# Altium schematic sheet 5600BB3T Dev.Board.SchDoc
size 594 x 420 mm; Author: A_D; Revision: Версия 1.0; SheetTotal: 1; PageSetup: Record=PageOptions|CenterHorizontal=True|CenterVertical=True|PrintScale=0.32|XCorrection=1.00|YCorrection=1.00|PrintKind=2|BorderSize=5000000|LeftOffset=9000|BottomOffset=10100|Orientation=2|PaperLength=11176|PaperWidth=8636|Scale=100|PaperSource=259|PrintQuality=600|MediaType=1|DitherType=10|PaperKind=Letter|PrintScaleMode=1; Weight: -; ScaleFactor: -
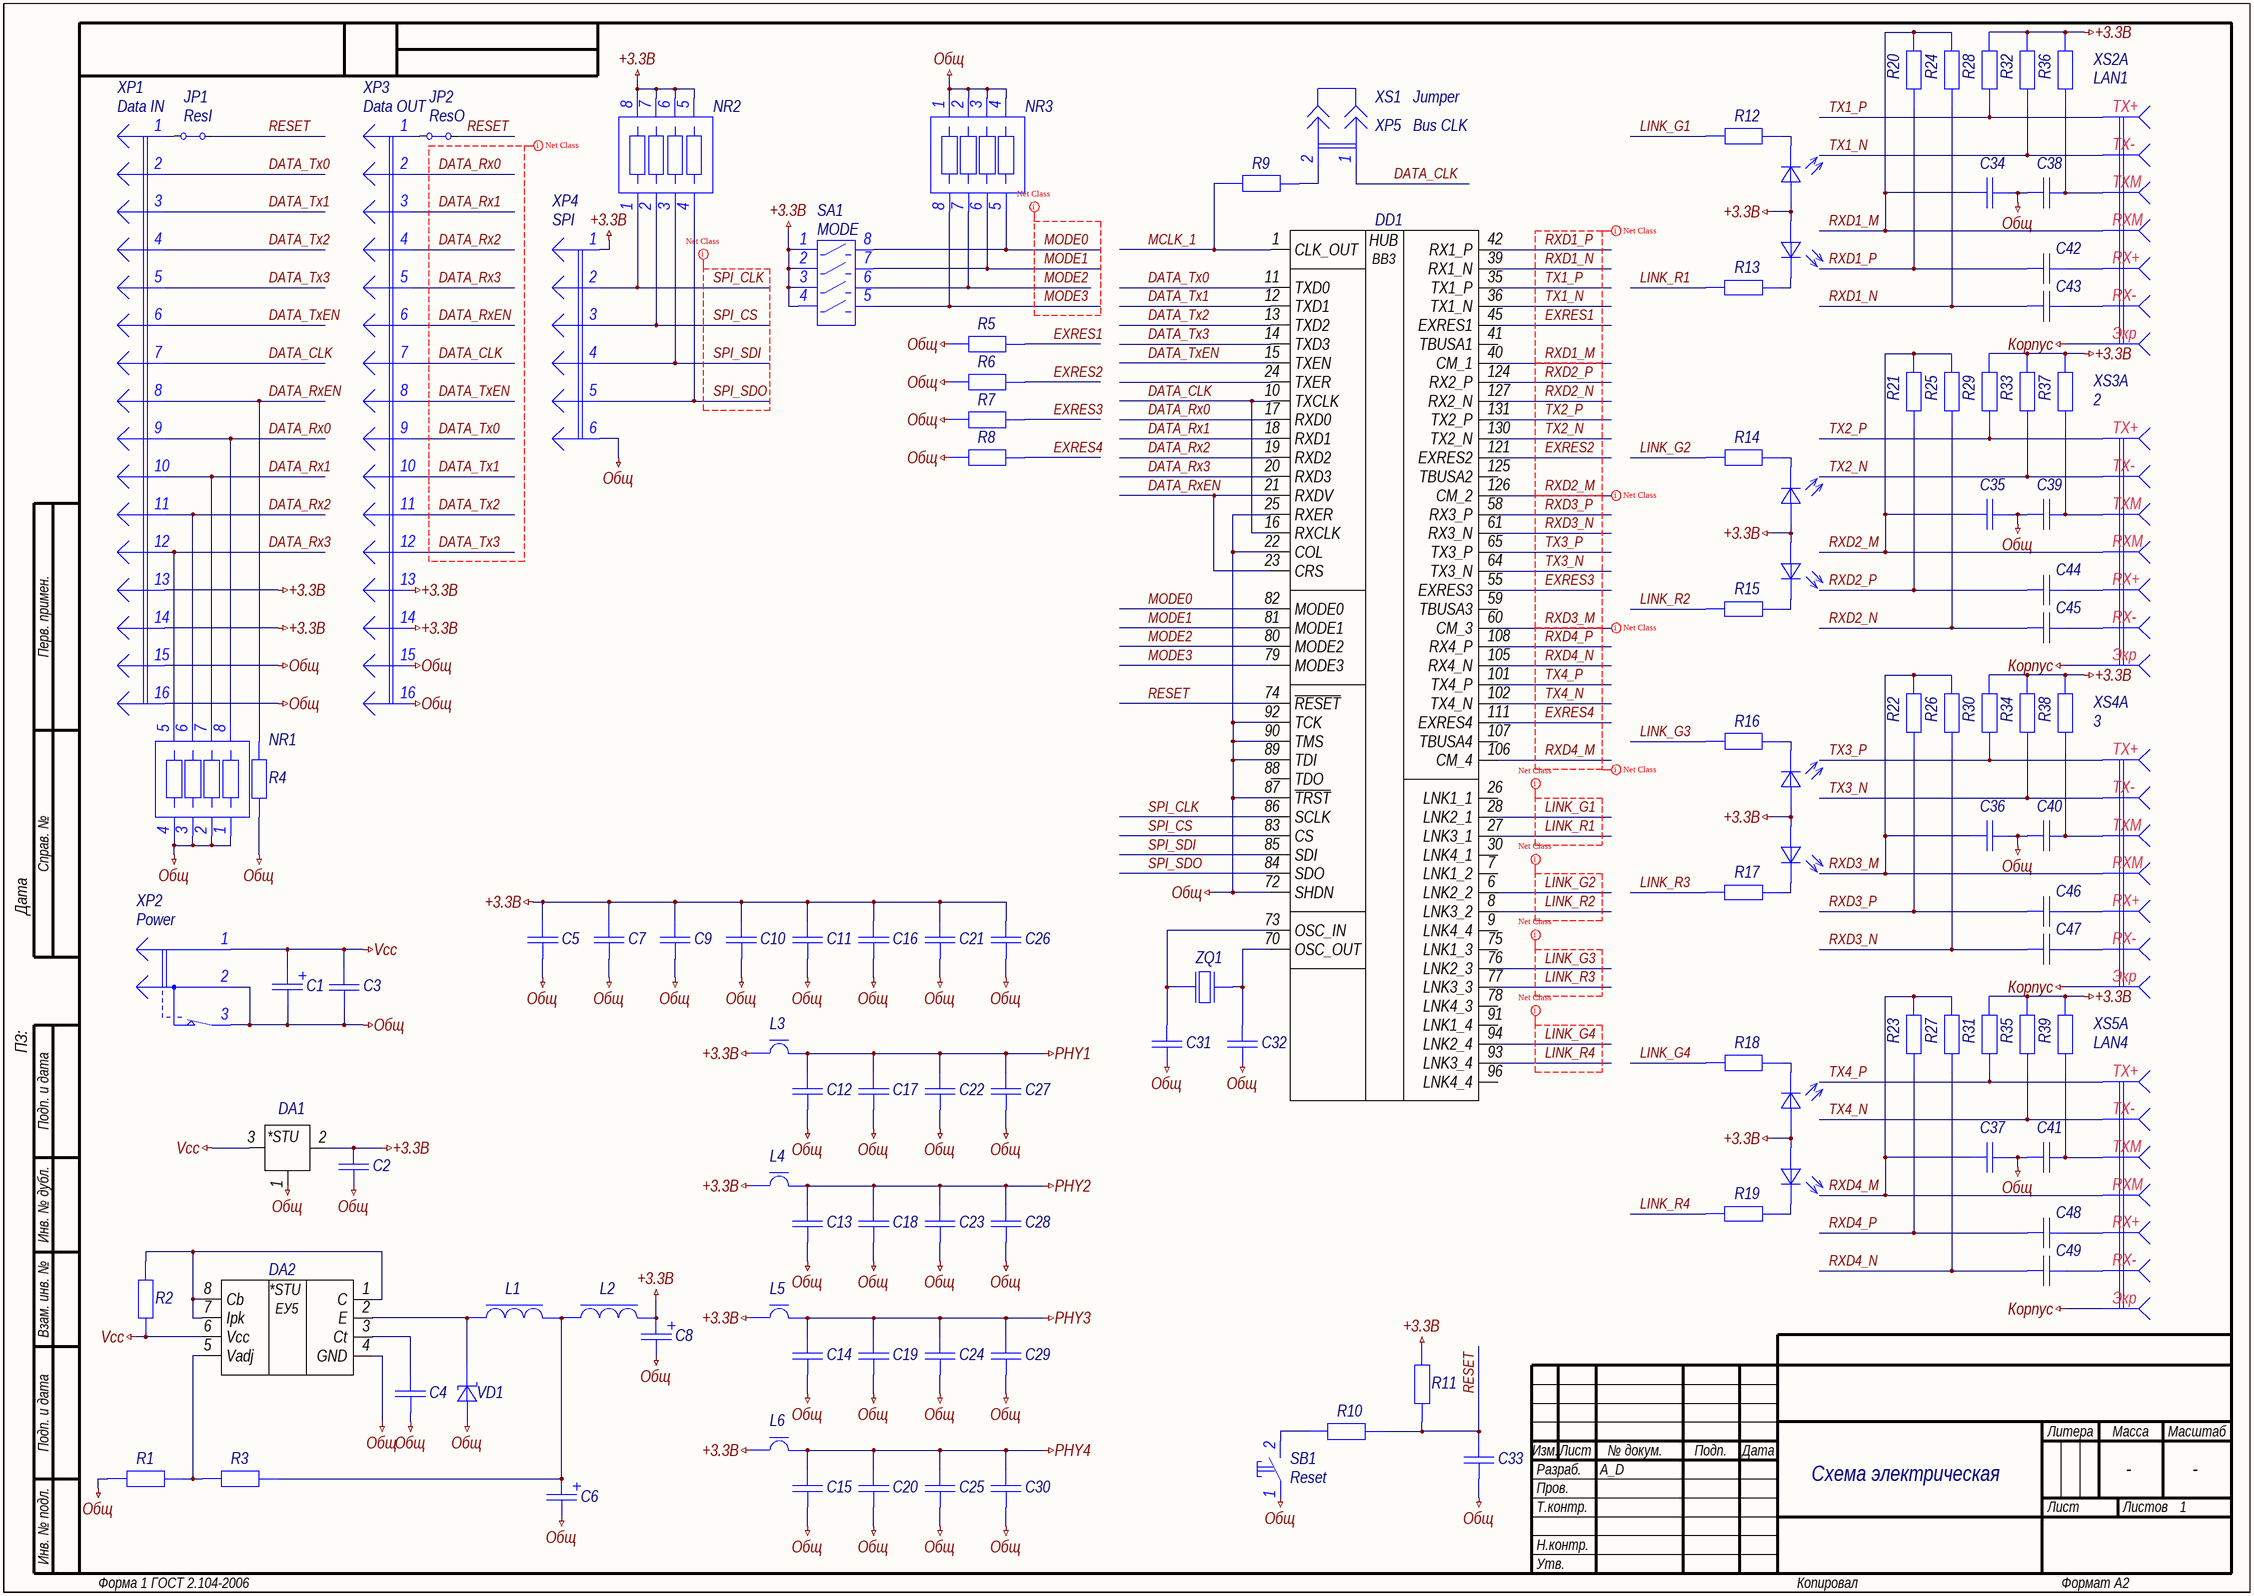
[diagram p0: 5600BB3T Dev.Board.SchDoc]

## Parts
C1  Capacitor-T  [C7343H-P]  (value not drawn)
C2  Capacitor  [C0805]  (value not drawn)  (no BOM)
C3  Capacitor  [C0805]  (value not drawn)
C4  Capacitor  [C0805]  (value not drawn)
C5  Capacitor  [C0805]  (value not drawn)
C6  Capacitor-T  [C7343H-P]  (value not drawn)
C7  Capacitor  [C0805]  (value not drawn)
C8  Capacitor-T  [C7343-P]  (value not drawn)
C9  Capacitor  [C0805]  (value not drawn)
C10  Capacitor  [C0805]  (value not drawn)
C11  Capacitor  [C0805]  (value not drawn)
C12  Capacitor  [C0805]  (value not drawn)
C13  Capacitor  [C0805]  (value not drawn)
C14  Capacitor  [C0805]  (value not drawn)
C15  Capacitor  [C0805]  (value not drawn)
C16  Capacitor  [C0805]  (value not drawn)
C17  Capacitor  [C0805]  (value not drawn)
C18  Capacitor  [C0805]  (value not drawn)
C19  Capacitor  [C0805]  (value not drawn)
C20  Capacitor  [C0805]  (value not drawn)
C21  Capacitor  [C0805]  (value not drawn)
C22  Capacitor  [C0805]  (value not drawn)
C23  Capacitor  [C0805]  (value not drawn)
C24  Capacitor  [C0805]  (value not drawn)
C25  Capacitor  [C0805]  (value not drawn)
C26  Capacitor  [C0805]  (value not drawn)
C27  Capacitor  [C0805]  (value not drawn)
C28  Capacitor  [C0805]  (value not drawn)
C29  Capacitor  [C0805]  (value not drawn)
C30  Capacitor  [C0805]  (value not drawn)
C31  Capacitor  [C0805]  (value not drawn)
C32  Capacitor  [C0805]  (value not drawn)
C33  Capacitor  [C0805]  (value not drawn)
C34  Capacitor  [C0805]  (value not drawn)
C35  Capacitor  [C0805]  (value not drawn)
C36  Capacitor  [C0805]  (value not drawn)
C37  Capacitor  [C0805]  (value not drawn)
C38  Capacitor  [C0805]  (value not drawn)
C39  Capacitor  [C0805]  (value not drawn)
C40  Capacitor  [C0805]  (value not drawn)
C41  Capacitor  [C0805]  (value not drawn)
C42  Capacitor  [C0805]  (value not drawn)
C43  Capacitor  [C0805]  (value not drawn)
C44  Capacitor  [C0805]  (value not drawn)
C45  Capacitor  [C0805]  (value not drawn)
C46  Capacitor  [C0805]  (value not drawn)
C47  Capacitor  [C0805]  (value not drawn)
C48  Capacitor  [C0805]  (value not drawn)
C49  Capacitor  [C0805]  (value not drawn)
DA1  LM1117-Series  [SOT-223]  (value not drawn)  (no BOM)
DA2  1156ЕУ5  [SO8]  (value not drawn)
DD1  5600ВВ3Т  [4229.132-3]  (value not drawn)
JP1  ResI  [JS-S-2x]  (net tie, no BOM)
JP2  ResO  [JS-S-2x]  (net tie, no BOM)
L1  Coil  [CDRH127]  (value not drawn)
L2  Coil  [SDR0604-Series]  (value not drawn)
L3  FerriteBead  [L0805]  (value not drawn)
L4  FerriteBead  [L0805]  (value not drawn)
L5  FerriteBead  [L0805]  (value not drawn)
L6  FerriteBead  [L0805]  (value not drawn)
NR1  Resistor-4  [CAY16-x4]  (value not drawn)
NR2  Resistor-4  [CAY16-x4]  (value not drawn)
NR3  Resistor-4  [CAY16-x4]  (value not drawn)
R1  Resistor  [R0805]  (value not drawn)
R2  Resistor  [R1206]  (value not drawn)
R3  Resistor  [R0805]  (value not drawn)
R4  Resistor  [R0805]  (value not drawn)
R5  Resistor  [R0805]  (value not drawn)
R6  Resistor  [R0805]  (value not drawn)
R7  Resistor  [R0805]  (value not drawn)
R8  Resistor  [R0805]  (value not drawn)
R9  Resistor  [R0805]  (value not drawn)
R10  Resistor  [R0805]  (value not drawn)
R11  Resistor  [R0805]  (value not drawn)
R12  Resistor  [R0805]  (value not drawn)
R13  Resistor  [R0805]  (value not drawn)
R14  Resistor  [R0805]  (value not drawn)
R15  Resistor  [R0805]  (value not drawn)
R16  Resistor  [R0805]  (value not drawn)
R17  Resistor  [R0805]  (value not drawn)
R18  Resistor  [R0805]  (value not drawn)
R19  Resistor  [R0805]  (value not drawn)
R20  Resistor  [R0805]  (value not drawn)
R21  Resistor  [R0805]  (value not drawn)
R22  Resistor  [R0805]  (value not drawn)
R23  Resistor  [R0805]  (value not drawn)
R24  Resistor  [R0805]  (value not drawn)
R25  Resistor  [R0805]  (value not drawn)
R26  Resistor  [R0805]  (value not drawn)
R27  Resistor  [R0805]  (value not drawn)
R28  Resistor  [R0805]  (value not drawn)
R29  Resistor  [R0805]  (value not drawn)
R30  Resistor  [R0805]  (value not drawn)
R31  Resistor  [R0805]  (value not drawn)
R32  Resistor  [R0805]  (value not drawn)
R33  Resistor  [R0805]  (value not drawn)
R34  Resistor  [R0805]  (value not drawn)
R35  Resistor  [R0805]  (value not drawn)
R36  Resistor  [R0805]  (value not drawn)
R37  Resistor  [R0805]  (value not drawn)
R38  Resistor  [R0805]  (value not drawn)
R39  Resistor  [R0805]  (value not drawn)
SA1  MODE  [ВДМЗ-4]
SB1  Reset  [ВКн1]
VD1  Schottky  [DO-214AA]  (value not drawn)
XP1  Data IN  [IDC-16MS]
XP2  Power  [DJK-02-Series]
XP3  Data OUT  [IDC-16MS]
XP4  SPI  [PLS-6]
XP5  Bus CLK  [PLS-2]
XS1  Jumper  [MJ-O-Series]
XS2  LAN1  [SK02-111006NL]  (parts A,B,C of 3)
XS3  2  [SK02-111006NL]  (parts A,B,C of 3)
XS4  3  [SK02-111006NL]  (parts A,B,C of 3)
XS5  LAN4  [SK02-111006NL]  (parts A,B,C of 3)
ZQ1  Crystal  [SMD 7x5mm]  (value not drawn)

## Nets
+3.3B: C2.2 C5.2 C7.2 C8.1 C9.2 C10.2 C11.2 C16.2 C21.2 C26.2 DA1.2(Out) DD1.3(Vcc) DD1.29(Vcc) DD1.67(Vcc) DD1.95(Vcc) L2.2 L3.1 L4.1 L5.1 L6.1 NR2.5 NR2.6 NR2.7 NR2.8 R11.2 R28.2 R29.2 R30.2 R31.2 R32.2 R33.2 R34.2 R35.2 R36.2 R37.2 R38.2 R39.2 SA1.1(A1) SA1.2(A2) SA1.3(A3) SA1.4(A4) XP1.13 XP1.14 XP3.13 XP3.14 XP4.1 XS2.9(LD1+) XS2.12(LD2+) XS3.9(LD1+) XS3.12(LD2+) XS4.9(LD1+) XS4.12(LD2+) XS5.9(LD1+) XS5.12(LD2+)
PHY1: C12.2 C17.2 C22.2 C27.2 DD1.37(Vcca1) DD1.43(Vcca1) DD1.47(Vcca1) DD1.49(Vcca1) L3.2
PHY2: C13.2 C18.2 C23.2 C28.2 DD1.117(Vcca2) DD1.119(Vcca2) DD1.123(Vcca2) DD1.129(Vcca2) L4.2
PHY3: C14.2 C19.2 C24.2 C29.2 DD1.51(Vcca3) DD1.53(Vcca3) DD1.56(Vcca3) DD1.63(Vcca3) L5.2
PHY4: C15.2 C20.2 C25.2 C30.2 DD1.103(Vcca4) DD1.109(Vcca4) DD1.113(Vcca4) DD1.115(Vcca4) L6.2
Vcc: C1.1 C3.2 DA1.3(In) DA2.6(Vcc) R2.1 XP2.1
Корпус: XS2.13 XS3.13 XS4.13 XS5.13
Общ: C1.2 C2.1 C3.1 C4.1 C5.1 C6.2 C7.1 C8.2 C9.1 C10.1 C11.1 C12.1 C13.1 C14.1 C15.1 C16.1 C17.1 C18.1 C19.1 C20.1 C21.1 C22.1 C23.1 C24.1 C25.1 C26.1 C27.1 C28.1 C29.1 C30.1 C31.1 C32.1 C33.1 C34.2 C35.2 C36.2 C37.2 C38.1 C39.1 C40.1 C41.1 DA1.1(Adj/GND) DA2.4(GND) DD1.4(GND) DD1.5(GND) DD1.22(COL) DD1.25(RXER) DD1.31(GND) DD1.33(GND) DD1.34(GNDА1) DD1.38(GNDА1) DD1.44(GNDА1) DD1.46(GNDА1) DD1.48(GNDА1) DD1.50(GND) DD1.52(GNDА3) DD1.54(GNDА3) DD1.57(GNDА3) DD1.62(GNDА3) DD1.66(GNDА3) DD1.68(GND) DD1.71(GND) DD1.72(SHDN) DD1.87(~{TRST}) DD1.89(TDI) DD1.90(TMS) DD1.92(TCK) DD1.97(GND) DD1.99(GND) DD1.100(GNDА4) DD1.104(GNDА4) DD1.110(GNDА4) DD1.112(GNDА4) DD1.114(GNDА4) DD1.116(GND) DD1.118(GNDА2) DD1.120(GNDА2) DD1.122(GNDА2) DD1.128(GNDА2) DD1.132(GNDА2) NR1.1 NR1.2 NR1.3 NR1.4 NR3.1 NR3.2 NR3.3 NR3.4 R1.2 R4.1 R5.1 R6.1 R7.1 R8.1 SB1.1 VD1.1(А) XP1.15 XP1.16 XP2.2 XP2.3 XP3.15 XP3.16 XP4.6
DATA_CLK: DD1.10(TXCLK) DD1.16(RXCLK) XP1.7 XP3.7 XP5.1
DATA_Rx0: DD1.17(RXD0) NR1.8 XP1.9 XP3.2
DATA_Rx1: DD1.18(RXD1) NR1.7 XP1.10 XP3.3
DATA_Rx2: DD1.19(RXD2) NR1.6 XP1.11 XP3.4
DATA_Rx3: DD1.20(RXD3) NR1.5 XP1.12 XP3.5
DATA_RxEN: DD1.21(RXDV) DD1.23(CRS) R4.2 XP1.8 XP3.6
DATA_Tx0: DD1.11(TXD0) XP1.2 XP3.9
DATA_Tx1: DD1.12(TXD1) XP1.3 XP3.10
DATA_Tx2: DD1.13(TXD2) XP1.4 XP3.11
DATA_Tx3: DD1.14(TXD3) XP1.5 XP3.12
DATA_TxEN: DD1.15(TXEN) XP1.6 XP3.8
EXRES1: DD1.45(EXRES1) R5.2
EXRES2: DD1.121(EXRES2) R6.2
EXRES3: DD1.55(EXRES3) R7.2
EXRES4: DD1.111(EXRES4) R8.2
LINK_G1: DD1.28(LNK2_1) R12.1
LINK_G2: DD1.6(LNK2_2) R14.1
LINK_G3: DD1.76(LNK2_3) R16.1
LINK_G4: DD1.94(LNK2_4) R18.1
LINK_R1: DD1.27(LNK3_1) R13.1
LINK_R2: DD1.8(LNK3_2) R15.1
LINK_R3: DD1.77(LNK3_3) R17.1
LINK_R4: DD1.93(LNK3_4) R19.1
MCLK_1: DD1.1(CLK_OUT) R9.1
MODE0: DD1.82(MODE0) NR3.5 SA1.8(A8)
MODE1: DD1.81(MODE1) NR3.6 SA1.7(A7)
MODE2: DD1.80(MODE2) NR3.7 SA1.6(A6)
MODE3: DD1.79(MODE3) NR3.8 SA1.5(A5)
RESET: C33.2 DD1.74(~{RESET}) JP1.2 JP2.2 R10.2 R11.1
RXD1_M: C34.1 DD1.40(CM_1) R20.2 R24.2 XS2.6
RXD1_N: C43.1 DD1.39(RX1_N) R24.1
RXD1_P: C42.1 DD1.42(RX1_P) R20.1
RXD2_M: C35.1 DD1.126(CM_2) R21.2 R25.2 XS3.6
RXD2_N: C45.1 DD1.127(RX2_N) R25.1
RXD2_P: C44.1 DD1.124(RX2_P) R21.1
RXD3_M: C36.1 DD1.60(CM_3) R22.2 R26.2 XS4.6
RXD3_N: C47.1 DD1.61(RX3_N) R26.1
RXD3_P: C46.1 DD1.58(RX3_P) R22.1
RXD4_M: C37.1 DD1.106(CM_4) R23.2 R27.2 XS5.6
RXD4_N: C49.1 DD1.105(RX4_N) R27.1
RXD4_P: C48.1 DD1.108(RX4_P) R23.1
SPI_CLK: DD1.86(SCLK) NR2.1 XP4.2
SPI_CS: DD1.83(СS) NR2.2 XP4.3
SPI_SDI: DD1.85(SDI) NR2.3 XP4.4
SPI_SDO: DD1.84(SDO) NR2.4 XP4.5
TX1_N: DD1.36(TX1_N) R32.1 XS2.2
TX1_P: DD1.35(TX1_P) R28.1 XS2.1
TX2_N: DD1.130(TX2_N) R33.1 XS3.2
TX2_P: DD1.131(TX2_P) R29.1 XS3.1
TX3_N: DD1.64(TX3_N) R34.1 XS4.2
TX3_P: DD1.65(TX3_P) R30.1 XS4.1
TX4_N: DD1.102(TX4_N) R35.1 XS5.2
TX4_P: DD1.101(TX4_P) R31.1 XS5.1
NetC4_2: C4.2 DA2.3(Ct)
NetC6_1: C6.1 L1.2 L2.1 R3.2
NetC31_2: C31.2 DD1.73(OSC_IN) ZQ1.1
NetC32_2: C32.2 DD1.70(OSC_OUT) ZQ1.3
NetC38_2: C38.2 R36.1 XS2.3
NetC39_2: C39.2 R37.1 XS3.3
NetC40_2: C40.2 R38.1 XS4.3
NetC41_2: C41.2 R39.1 XS5.3
NetC42_2: C42.2 XS2.7
NetC43_2: C43.2 XS2.8
NetC44_2: C44.2 XS3.7
NetC45_2: C45.2 XS3.8
NetC46_2: C46.2 XS4.7
NetC47_2: C47.2 XS4.8
NetC48_2: C48.2 XS5.7
NetC49_2: C49.2 XS5.8
NetDA2_1: DA2.1(С) DA2.7(Ipk) DA2.8(Cb) R2.2
NetDA2_2: DA2.2(E) L1.1 VD1.2(К)
NetDA2_5: DA2.5(Vadj) R1.1 R3.1
NetJP1_1: JP1.1 XP1.1
NetJP2_1: JP2.1 XP3.1
NetR9_2: R9.2 XP5.2
NetR10_1: R10.1 SB1.2
NetR12_2: R12.2 XS2.10(LD1-)
NetR13_2: R13.2 XS2.11(LD2-)
NetR14_2: R14.2 XS3.10(LD1-)
NetR15_2: R15.2 XS3.11(LD2-)
NetR16_2: R16.2 XS4.10(LD1-)
NetR17_2: R17.2 XS4.11(LD2-)
NetR18_2: R18.2 XS5.10(LD1-)
NetR19_2: R19.2 XS5.11(LD2-)

Not connected (* = marked no-connect by the designer): DD1 2(DVcc) 7(LNK1_2) 9(LNK4_4) 24(TXER) 26(LNK1_1) 30(LNK4_1) 32(DVcc) 41(TBUSA1) 59(TBUSA3) 69(DVcc) 75(LNK1_3) 78(LNK4_3) 88(TDO) 91(LNK1_4) 96(LNK4_4) 98(DVcc) 107(TBUSA4) 125(TBUSA2)

## Layout directives
net class SPI: SPI_CLK, SPI_CS, SPI_SDI, SPI_SDO
net class MII: DATA_CLK, DATA_Rx0, DATA_Rx1, DATA_Rx2, DATA_Rx3, DATA_RxEN, DATA_Tx0, DATA_Tx1, DATA_Tx2, DATA_Tx3, DATA_TxEN
net class MODE: MODE0, MODE1, MODE2, MODE3
net class LAN1: EXRES1, LINK_G1, LINK_R1, RXD1_M, RXD1_N, RXD1_P, TX1_N, TX1_P
net class LAN2: LINK_G2, LINK_R2, RXD2_M
net class LAN3: LINK_G3, LINK_R3, RXD3_M
net class LAN4: EXRES4, LINK_G4, LINK_R4, RXD3_M, RXD4_M, RXD4_N, RXD4_P, TX4_N, TX4_P

## Notes on the sheet
- Схема электрическая
  принципиальная
- Перв. примен.
- Справ. №
- ПЗ:                             Дата
- Подп. и дата
- Инв. № дубл.
- Взам. инв. №
- Разраб.
- Изм.
- Лист
- № докум.
- Подп.
- Дата
- Литера
- Масса
- Масштаб
- Пров.
- Т.контр.
- Листов
- Инв. № подл.
- Н.контр.
- Утв.
- Форма 1 ГОСТ 2.104-2006
- Копировал
- Формат А2
- (in symbol 5600ВВ3Т) HUB; ВВ3
- (in symbol LM1117MPX-3.3) *STU
- (in symbol SK02-111006NL, part A) TX+; TX-; TXM; RXM; RX+; RX-; Экр
- (in symbol К1156ЕУ5ВТ) *STU; ЕУ5

## Library data of the parts
C1 = К53-65 ”E”-20В-100мкФ±20%: Manufacturer: ОАО "Элеконд"; Type: Конденсатор; ID: 30; Value: 100uF; Voltage: 20V; Tolerance: ±20%; ESR: 0.88ohm; Leakage Current: 20uA; ESL: 0.9ohm; Specification: АЖЯР.673546.004 ТУ; Working Temperature: -60°С...+125°С; Published: 23.04.2010; Publisher: A_D; Part Number: К53-65 ”E”-20В-100мкФ±20%; Footprint: Type E
C2 C3 C5 C9 C11-C15 C21-C25 C33 = К10-69в-Н90-25в-2012М-0,1мкф: Manufacturer: ОАО "НИИ "Гириконд"; Type: Конденсатор; ID: 3; Value: 0.1uF; Voltage: 25V; Tolerance: +80/-20%; Dielectric Type: Н90; Specification: АЖЯР.673511.002 ТУ; Published: 18.05.2010; Publisher: A_D; Part Number: К10-69в-Н90-25в-2012М-0,1мкф; Footprint: 0805
C4 = К10-69в-Н30-50в-2012М-220пФ±20%: Manufacturer: ОАО "НИИ "Гириконд"; Type: Конденсатор; ID: 19; Value: 220p; Voltage: 50V; Tolerance: ±20%; Dielectric Type: Н30; Specification: АЖЯР.673511.002 ТУ; Published: 18.05.2010; Publisher: A_D; Part Number: К10-69в-Н30-50в-2012М-220пФ±20%; Footprint: 0805
C6 = К53-65 ”E”-6,3В-470мкФ±20%: Manufacturer: ОАО "Элеконд"; Type: Конденсатор; ID: 31; Value: 470uF; Voltage: 6.3V; Tolerance: ±20%; ESR: 0.78ohm; Leakage Current: 28.2uA; ESL: 0.9ohm; Specification: АЖЯР.673546.004 ТУ; Working Temperature: -60°С...+125°С; Published: 23.04.2010; Publisher: A_D; Part Number: К53-65 ”E”-6,3В-470мкФ±20%; Footprint: Type E
C7 C10 C16-C20 C26-C30 = К10-69в-МП0-50в-2012М-100пФ±5%: Manufacturer: ОАО "НИИ "Гириконд"; Type: Конденсатор; ID: 2; Value: 100p; Voltage: 50V; Tolerance: ±5%; Dielectric Type: МП0; Specification: АЖЯР.673511.002 ТУ; Published: 18.05.2010; Publisher: A_D; Part Number: К10-69в-МП0-50в-2012М-100пФ±5%; Footprint: 0805
C8 = К53-65 ”D”-6,3В-68мкФ±20%: Manufacturer: ОАО "Элеконд"; Type: Конденсатор; ID: 3; Value: 68uF; Voltage: 6.3V; Tolerance: ±20%; ESR: 0.88ohm; Leakage Current: 4.1uA; ESL: 0.9ohm; Specification: АЖЯР.673546.004 ТУ; Working Temperature: -60°С...+125°С; Published: 23.04.2010; Publisher: A_D; Part Number: К53-65 ”D”-6,3В-68мкФ±20%; Footprint: Type D
C31 C32 = К10-69в-МП0-50в-2012М-15пФ±5%: Manufacturer: ОАО "НИИ "Гириконд"; Type: Конденсатор; ID: 17; Value: 15p; Voltage: 50V; Tolerance: ±5%; Dielectric Type: МП0; Specification: АЖЯР.673511.002 ТУ; Published: 18.05.2010; Publisher: A_D; Part Number: К10-69в-МП0-50в-2012М-15пФ±5%; Footprint: 0805
C34-C37 = К10-69в-Н30-50в-2012М-0,01мкф: Manufacturer: ОАО "НИИ "Гириконд"; Type: Конденсатор; ID: 22; Value: 0.01uF; Voltage: 50V; Tolerance: ±20%; Dielectric Type: Н30; Specification: АЖЯР.673511.002 ТУ; Published: 18.05.2010; Publisher: A_D; Part Number: К10-69в-Н30-50в-2012М-0,01мкф; Footprint: 0805
C38-C41 = К10-69в-Н90-25в-2012М-0,022мкф: Manufacturer: ОАО "НИИ "Гириконд"; Type: Конденсатор; ID: 15; Value: 0.022uF; Voltage: 25V; Tolerance: +80/-20%; Dielectric Type: Н90; Specification: АЖЯР.673511.002 ТУ; Published: 18.05.2010; Publisher: A_D; Part Number: К10-69в-Н90-25в-2012М-0,022мкф; Footprint: 0805
C42-C49 = К10-69в-Н30-50в-2012М-6800пФ±20%: Manufacturer: ОАО "НИИ "Гириконд"; Type: Конденсатор; ID: 16; Value: 6800p; Voltage: 50V; Tolerance: ±20%; Dielectric Type: Н30; Specification: АЖЯР.673511.002 ТУ; Published: 18.05.2010; Publisher: A_D; Part Number: К10-69в-Н30-50в-2012М-6800пФ±20%; Footprint: 0805
DA1 = LM1117MPX-3.3: ID: 9; Input Voltage: +8.5…20V; Output Current: 800mA; Output Voltage: +3.3V; Published: 13.08.2015; Publisher: A_D; Type: Микросхема; Part Number: LM1117MPX-3.3; Value: LM1117MPX-3.3
DA2 = К1156ЕУ5ВТ: ID: 2; Input Voltage: +3…40V; Output Current: 1.5A; Output Voltage: +1.25...37V; Efficiency: >84%; Total Power Dissipation: 1.25W; Frequency: <100kHz; Type: Микросхема; Published: 23.07.2014; Publisher: A_D; Part Number: К1156ЕУ5ВТ; Value: К1156ЕУ5ВТ; Shutdown Input: -
DD1 = 5600ВВ3Т: Manufacturer: ЗАО "ПКК Миландр"; ID: 2; Value: 5600ВГ1У; Supply Operation: +4.5…5.5V; Supply Current: <190mA; Ethernet Speed: 10BASE-T; SRAM: 8Kb; Interface: Parallel 16bit; Specification: АЕНВ.431290.084 ТУ; Application Category: 1 / 5; Working Temperature: -60°С...+85°С; Type: Микросхема; Published: 16.06.2014; Publisher: A_D; Part Number: 5600ВВ3Т; Functional Analog: -
JP1 JP2 = Перемычка (SMT): ID: 13; Published: 24.06.2014; Publisher: A_D; Type: Перемычка; Part Number: Перемычка (SMT)
L1 = CDRH127NP-101M: Type: Дроссель; ID: 21; Value: 100uH; Rated Current: 1.7A; Tolerance: ±20%; DC Resistance: 0.22ohm; Published: 20.05.2010; Publisher: A_D; Part Number: CDRH127NP-101M; Inductance: 100uH
L2 = SDR0604-4R7ML: Manufacturer: Bourns; Type: Дроссель; ID: 63; Rated Current: 3A; Tolerance: ±20%; Inductance: 4.7uH; Q: 20; DC Resistance: 0.08ohm; Self-Resonant Frequency: 34MHz; Published: 20.05.2010; Publisher: A_D; Part Number: SDR0604-4R7ML; Value: SDR0604-4R7ML; Footprint: SDR0604
L3-L6 = BLM21PG331SN1: Manufacturer: Murata; Type: Дроссель; ID: 2; Rated Current: 1.5A; Impedance at 100Mhz: 0.07ohm; Inductor Type: EMIFIL; Working Temperature: -55°С...+125°С; Published: 14.11.2014; Publisher: A_D; Part Number: BLM21PG331SN1; Value: BLM21PG331SN1; Footprint: 0805
NR1-NR3 = НР1-3Р-10кОм ±5%: ID: 59; Value: 10k; Limit Voltage: 50V; Tolerance: ±5%; Total Power Dissipation: 0,062W; Specification: ШКАБ.434110.018 ТУ; Published: 15.07.2014; Publisher: A_D; Type: Набор резисторов; Part Number: НР1-3Р-10кОм ±5%
R1 = Р1-12-0,125-5,1 кОм±5%-М: ID: 72; Value: 5.1k; Limit Voltage: 150V; Tolerance: ±5%; Total Power Dissipation: 0,125W; Specification: ШКАБ.434110.002 ТУ; Published: 24.03.2010; Publisher: A_D; Type: Резистор; Part Number: Р1-12-0,125-5,1 кОм±5%-М; Footprint: 0805
R2 = Р1-12-0,25-0,33 Ом±5%-М: ID: 73; Value: 0.33; Limit Voltage: 200V; Tolerance: ±5%; Total Power Dissipation: 0,25W; Specification: ШКАБ.434110.002 ТУ; Published: 24.03.2010; Publisher: A_D; Type: Резистор; Part Number: Р1-12-0,25-0,33 Ом±5%-М; Footprint: 1206
R3 = Р1-12-0,125-10 кОм±5%-М: ID: 4; Value: 10k; Limit Voltage: 150V; Tolerance: ±5%; Total Power Dissipation: 0,125W; Specification: ШКАБ.434110.002 ТУ; Published: 24.03.2010; Publisher: A_D; Type: Резистор; Part Number: Р1-12-0,125-10 кОм±5%-М; Footprint: 0805
R4 R11 = Р1-12-0,125-47 кОм±5%-М: ID: 38; Value: 47k; Limit Voltage: 150V; Tolerance: ±5%; Total Power Dissipation: 0,125W; Specification: ШКАБ.434110.002 ТУ; Published: 24.03.2010; Publisher: A_D; Type: Резистор; Part Number: Р1-12-0,125-47 кОм±5%-М; Footprint: 0805
R5-R8 = Р1-12-0,125-12,4 кОм±1%-М: ID: 55; Value: 12.4k; Limit Voltage: 150V; Tolerance: ±1%; Total Power Dissipation: 0,125W; Specification: ШКАБ.434110.002 ТУ; Published: 24.03.2010; Publisher: A_D; Type: Резистор; Part Number: Р1-12-0,125-12,4 кОм±1%-М; Footprint: 0805
R9 R36-R39 = Р1-12-0,125-10 Ом±5%-М: ID: 53; Value: 10; Limit Voltage: 150V; Tolerance: ±5%; Total Power Dissipation: 0,125W; Specification: ШКАБ.434110.002 ТУ; Published: 24.03.2010; Publisher: A_D; Type: Резистор; Part Number: Р1-12-0,125-10 Ом±5%-М; Footprint: 0805
R10 = Р1-12-0,125-100 Ом±5%-М: ID: 3; Value: 100; Limit Voltage: 150V; Tolerance: ±5%; Total Power Dissipation: 0,125W; Specification: ШКАБ.434110.002 ТУ; Published: 24.03.2010; Publisher: A_D; Type: Резистор; Part Number: Р1-12-0,125-100 Ом±5%-М; Footprint: 0805
R12-R19 = Р1-12-0,125-470 Ом±5%-М: ID: 7; Value: 470; Limit Voltage: 150V; Tolerance: ±5%; Total Power Dissipation: 0,125W; Specification: ШКАБ.434110.002 ТУ; Published: 24.03.2010; Publisher: A_D; Type: Резистор; Part Number: Р1-12-0,125-470 Ом±5%-М; Footprint: 0805
R20-R27 = Р1-12-0,125-82 Ом±5%-М: ID: 54; Value: 82; Limit Voltage: 150V; Tolerance: ±5%; Total Power Dissipation: 0,125W; Specification: ШКАБ.434110.002 ТУ; Published: 24.03.2010; Publisher: A_D; Type: Резистор; Part Number: Р1-12-0,125-82 Ом±5%-М; Footprint: 0805
R28-R35 = Р1-12-0,125-49,9 Ом±1%-М: ID: 42; Value: 49.9; Limit Voltage: 150V; Tolerance: ±1%; Total Power Dissipation: 0,125W; Specification: ШКАБ.434110.002 ТУ; Published: 24.03.2010; Publisher: A_D; Type: Резистор; Part Number: Р1-12-0,125-49,9 Ом±1%-М; Footprint: 0805
SA1 = ВДМЗ-4: ID: 8; Value: ВДМЗ-4; Limit Voltage: 36V; Limit Current: 250mA; Number of Switches: 4; Backlight: NO; Specification: АГ0.360.045 ТУ; Published: 09.06.2014; Publisher: A_D; Type: Набор переключателей; Part Number: ВДМЗ-4; Number of Contacts: 8
SB1 = ВКн1: ID: 9; Value: ВКн1; Limit Voltage: 15V; Limit Current: 50mA; Resistance: 0.1ohm; Isolator Resistance: 100meg; Backlight: NO; Number of Contacts: 4; Specification: АСЖР.642130.003 ТУ; Published: 17.04.2014; Publisher: A_D; Type: Переключатель кнопочный; Part Number: ВКн1; Height: 5.2mm
VD1 = SS26: Part Number: SS26; Type: Диод; ID: 6; Value: SS26; Reverse Voltage: 60V; Reverse Current: 0.4mA; Forward Voltage: 0.7V; Forward Current: 2A; Application Category: 1; Published: 18.05.2010; Publisher: A_D
XP1 XP3 = СНП347-16ВП22-В: Specification: РЮМК.430420.012 ТУ; ID: 18; Limit Voltage: 250V; Limit Current: 1A; Connector Type: Male; Resistance: 50momh; Surface Finish: Silver; Pitch: 1.27mm; Value: СНП347-16ВП22-В; Published: 07.03.2013; Publisher: A_D; Type: Вилка; Part Number: СНП347-16ВП22-В; Pins: 16
XP2 = DJK-02A: ID: 35; Limit Voltage: 250V; Limit Current: 2A; Connector Type: Male; Resistance: 20momh; Surface Finish: Bronze; Value: DJK-02A; Published: 07.03.2013; Publisher: A_D; Type: Вилка; Part Number: DJK-02A; Pins: 3
XP4 = СНП346-6ВП22-1-В: Specification: РЮМК.430420.011 ТУ; ID: 6; Limit Voltage: 250V; Limit Current: 1A; Connector Type: Male; Resistance: 15mohm; Surface Finish: Silver; Pitch: 2.54mm; Value: СНП346-6ВП22-1-В; Published: 07.03.2013; Publisher: A_D; Type: Вилка; Part Number: СНП346-6ВП22-1-В; Pins: 6
XP5 = СНП346-2ВП22-1-В: Specification: РЮМК.430420.011 ТУ; ID: 2; Limit Voltage: 250V; Limit Current: 1A; Connector Type: Male; Resistance: 15mohm; Surface Finish: Silver; Pitch: 2.54mm; Value: СНП346-2ВП22-1-В; Published: 07.03.2013; Publisher: A_D; Type: Вилка; Part Number: СНП346-2ВП22-1-В; Pins: 2
XS1 = MJ-O-8: Part Number: MJ-O-8; ID: 21; Value: MJ-O-8; Limit Voltage: 650V; Rated Current: 3A; Resistance: 0.3ohm; Published: 04.09.2014; Publisher: A_D; Type: Розетка; Application Type: Jumper; Footprint: NA
XS2-XS5 = SK02-111006NL: Manufacturer: Sanken Electric Co., Ltd.; ID: 18; Limit Voltage: 125V; Limit Current: 1.5A; Connector Type: Female; Interface: Ethernet/Int.Trans.; Max Data Rate: 10/100Mb; Value: SK02-111006NL; Published: 08.09.2014; Publisher: A_D; Type: Розетка; Part Number: SK02-111006NL; Pins: 12; Mount Type: Through hole
ZQ1 = РК457-8ВП-25000К-16пФ: Manufacturer: Пьезотрон; ID: 10; Output Frequency: 25MHz; Load Capacitance: 15pF; Specification: КЖБД.433514.019 ТУ; Working Temperature: -40°С...+70°С; Published: 08.03.2013; Publisher: A_D; Type: Резонатор; Part Number: РК457-8ВП-25000К-16пФ; Value: РК457-8ВП-25000К